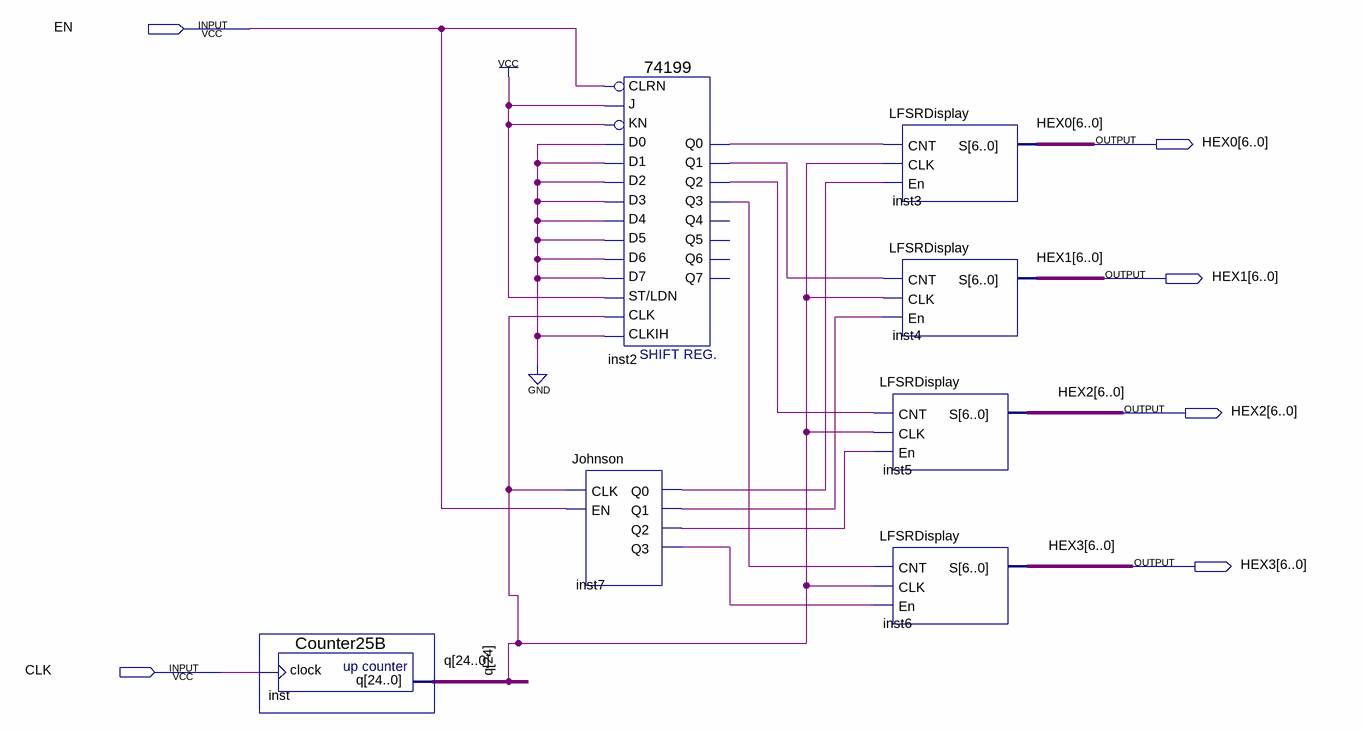
[diagram p0: schematic sheet]
// Quartus schematic TB.bdf as structural Verilog: 7 symbols, 6 pins
module TB (
  input  EN,
  input  CLK,
  output [6:0] HEX0,
  output [6:0] HEX1,
  output [6:0] HEX2,
  output [6:0] HEX3
);

  wire inst2_q0, inst2_q1, inst2_q2, inst2_q3, inst7_q0, inst7_q1, inst7_q2, inst7_q3;
  wire [24:0] q;

  Counter25B inst (.clock(CLK), .q(q));
  \74199  inst2 (
    .KN(1'b1), .CLRN(EN), .\ST/LDN (1'b1), .CLK(q[24]), .J(1'b1), .D3(1'b0), .D2(1'b0), .D1(1'b0), .D0(1'b0),
    .D7(1'b0), .D6(1'b0), .CLKIH(1'b0), .D4(1'b0), .D5(1'b0), .Q2(inst2_q2), .Q3(inst2_q3), .Q0(inst2_q0),
    .Q1(inst2_q1));  // open: Q5, Q6, Q7, Q4
  Johnson inst7 (.CLK(q[24]), .EN(EN), .Q0(inst7_q0), .Q1(inst7_q1), .Q2(inst7_q2), .Q3(inst7_q3));
  LFSRDisplay inst3 (.CNT(inst2_q0), .CLK(q[24]), .En(inst7_q0), .S(HEX0));
  LFSRDisplay inst4 (.CNT(inst2_q1), .CLK(q[24]), .En(inst7_q1), .S(HEX1));
  LFSRDisplay inst5 (.CNT(inst2_q2), .CLK(q[24]), .En(inst7_q2), .S(HEX2));
  LFSRDisplay inst6 (.CNT(inst2_q3), .CLK(q[24]), .En(inst7_q3), .S(HEX3));
endmodule
